# EAGLE design beatrix_B_v1_1 (EAGLE 9.6.2)

## Sheet 1 of 5: Audio I/O
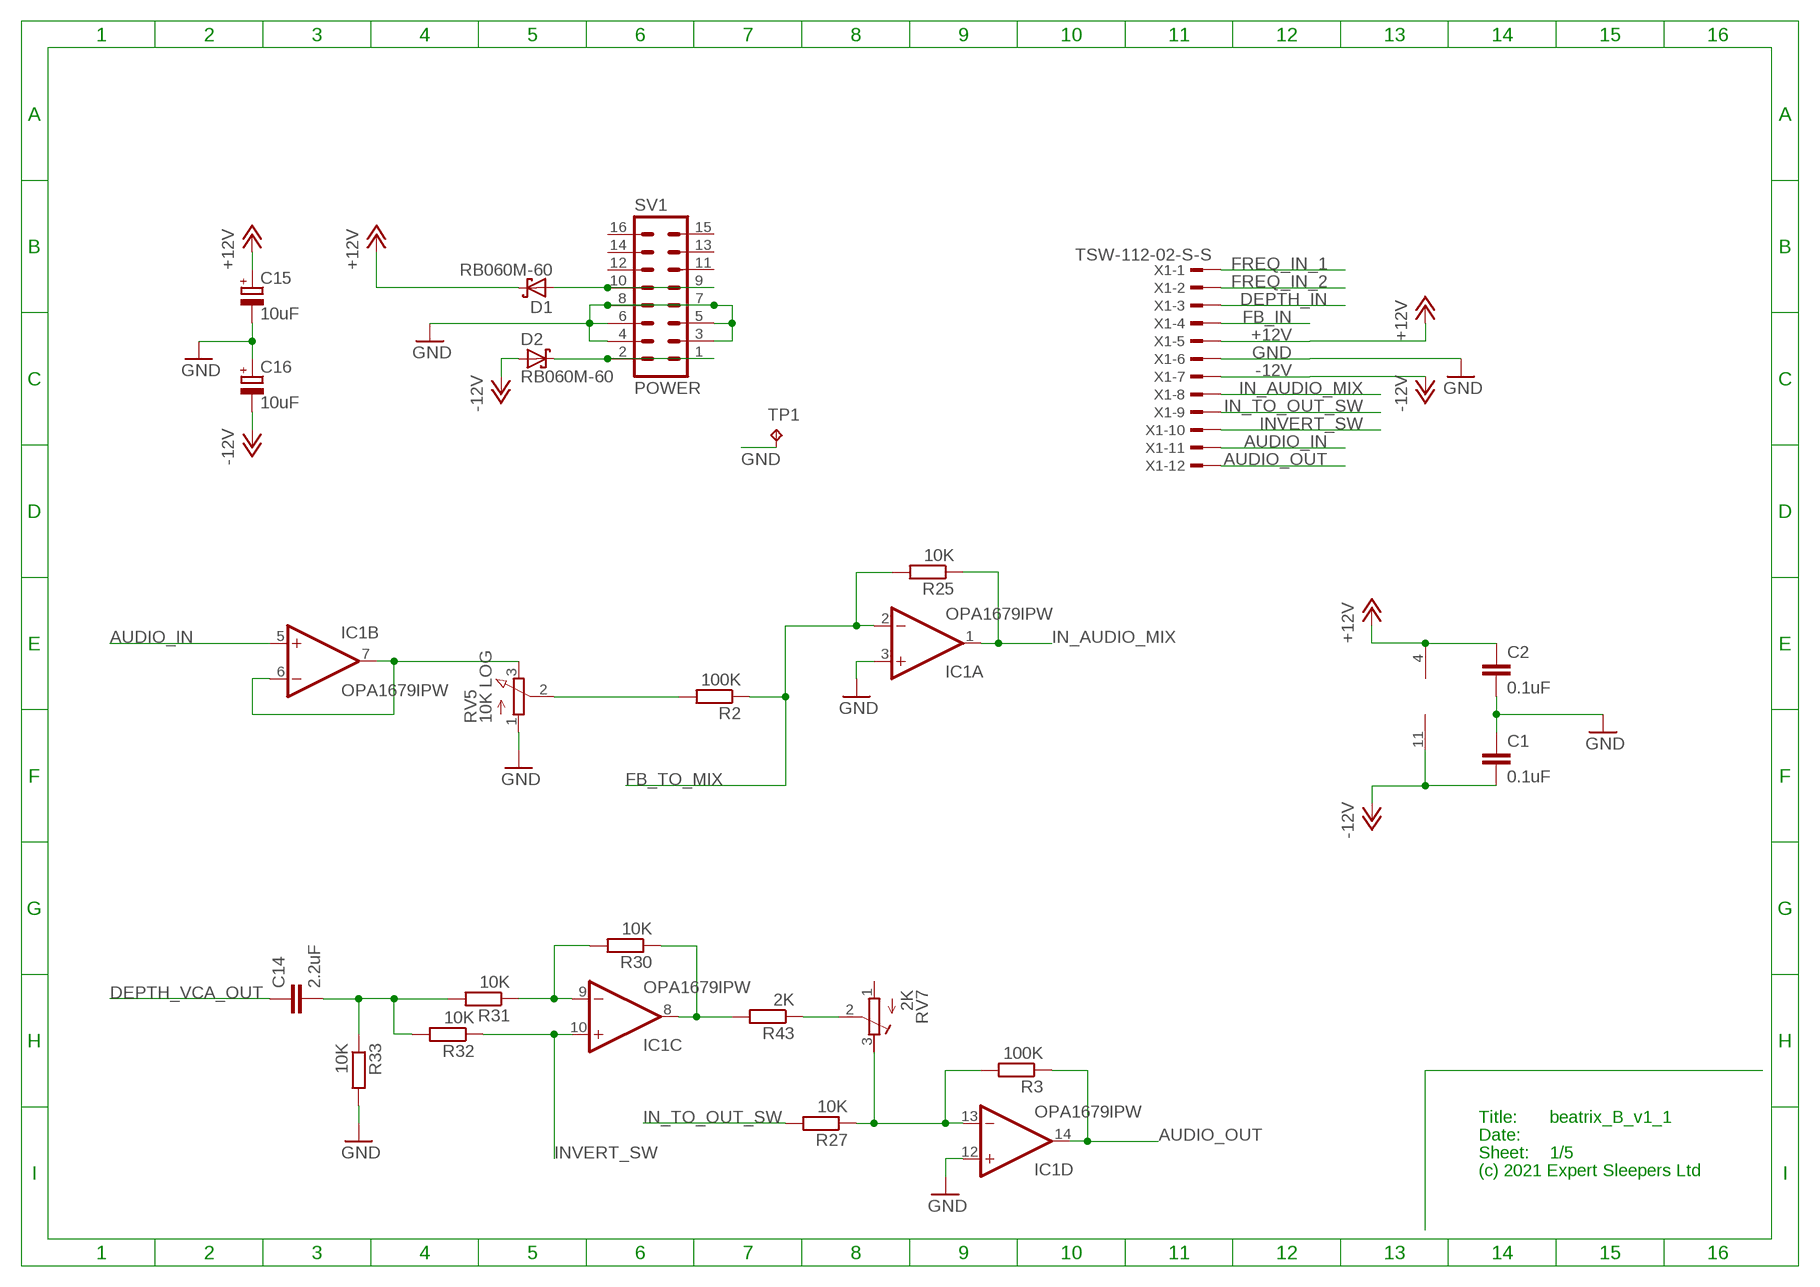
[diagram p0: schematic, sheet 1]

### Parts
C1  0.1uF  C-EUC0402  [C0402]
C2  0.1uF  C-EUC0402  [C0402]
C14  2.2uF  C-EUC0805  [C0805]
C15  10uF  CPOL-EUUD-4X5,8  [UD-4X5,8_NICHICON]
C16  10uF  CPOL-EUUD-4X5,8  [UD-4X5,8_NICHICON]
D1  RB060M-60  [SOD123FL]
D2  RB060M-60  [SOD123FL]
IC1  OPA1679IPW  TL074PW  [PW_R-PDSO-G14]
R2  100K  R-EU_R0603  [R0603]
R3  100K  R-EU_R0603  [R0603]
R25  10K  R-EU_R0603  [R0603]
R27  10K  R-EU_R0603  [R0603]
R30  10K  R-EU_R0603  [R0603]
R31  10K  R-EU_R0603  [R0603]
R32  10K  R-EU_R0603  [R0603]
R33  10K  R-EU_R0603  [R0603]
R43  2K  R-EU_R0603  [R0603]
RV5  10K LOG  RD1610NOA0X  [RD1610NOA0X]
RV7  2K  TC33X  [TC33X]
SV1  POWER  ML16  [ML16]
TP1  RA2  TPPAD1-13  [P1-13]
X1  TSW-112-02-S-S  [TSW-112-02-S-S]

### Nets
+12V: C2.1 C15.+ D1.C IC1.4(P:V+) X1.5 ; also sheet 2,3,4,5
-12V: C1.2 C16.- D2.A IC1.11(P:V-) X1.7 ; also sheet 2,3,4,5
AUDIO_IN: IC1.5(B:+IN) X1.11
AUDIO_OUT: IC1.14(D:OUT) R3.1 X1.12
DEPTH_IN: X1.3 ; also sheet 3
DEPTH_VCA_OUT: C14.1 ; also sheet 3
FB_IN: X1.4 ; also sheet 2
FB_TO_MIX: IC1.2(A:-IN) R2.1 R25.2 ; also sheet 2
FREQ_IN_1: X1.1 ; also sheet 4
FREQ_IN_2: X1.2 ; also sheet 4
GND [power]: C1.1 C2.2 C15.- C16.+ IC1.3(A:+IN) IC1.12(D:+IN) R33.2 RV5.1(A) SV1.3 SV1.4 SV1.5 SV1.6 SV1.7 SV1.8 TP1.TP X1.6 ; also sheet 2,3,4,5
IN_AUDIO_MIX: IC1.1(A:OUT) R25.1 X1.8 ; also sheet 5
IN_TO_OUT_SW: R27.2 X1.9
INVERT_SW: IC1.10(C:+IN) R32.1 X1.10
N$1: D2.C SV1.1 SV1.2
N$3: IC1.8(C:OUT) R30.1 R43.2
N$5: IC1.13(D:-IN) R3.2 R27.1 RV7.3(E)
N$7: IC1.6(B:-IN) IC1.7(B:OUT) RV5.3(E)
N$10: R2.2 RV5.2(S)
N$15: D1.A SV1.9 SV1.10
N$49: C14.2 R31.2 R32.2 R33.1
N$50: R43.1 RV7.2(S)
N$51: IC1.9(C:-IN) R30.2 R31.1
Unconnected: RV7.1(A) SV1.11 SV1.12 SV1.13 SV1.14 SV1.15 SV1.16

### Notes on the sheet
- Title:
- Date:
- Sheet:
- (c) 2021 Expert Sleepers Ltd

## Sheet 2 of 5: Feedback
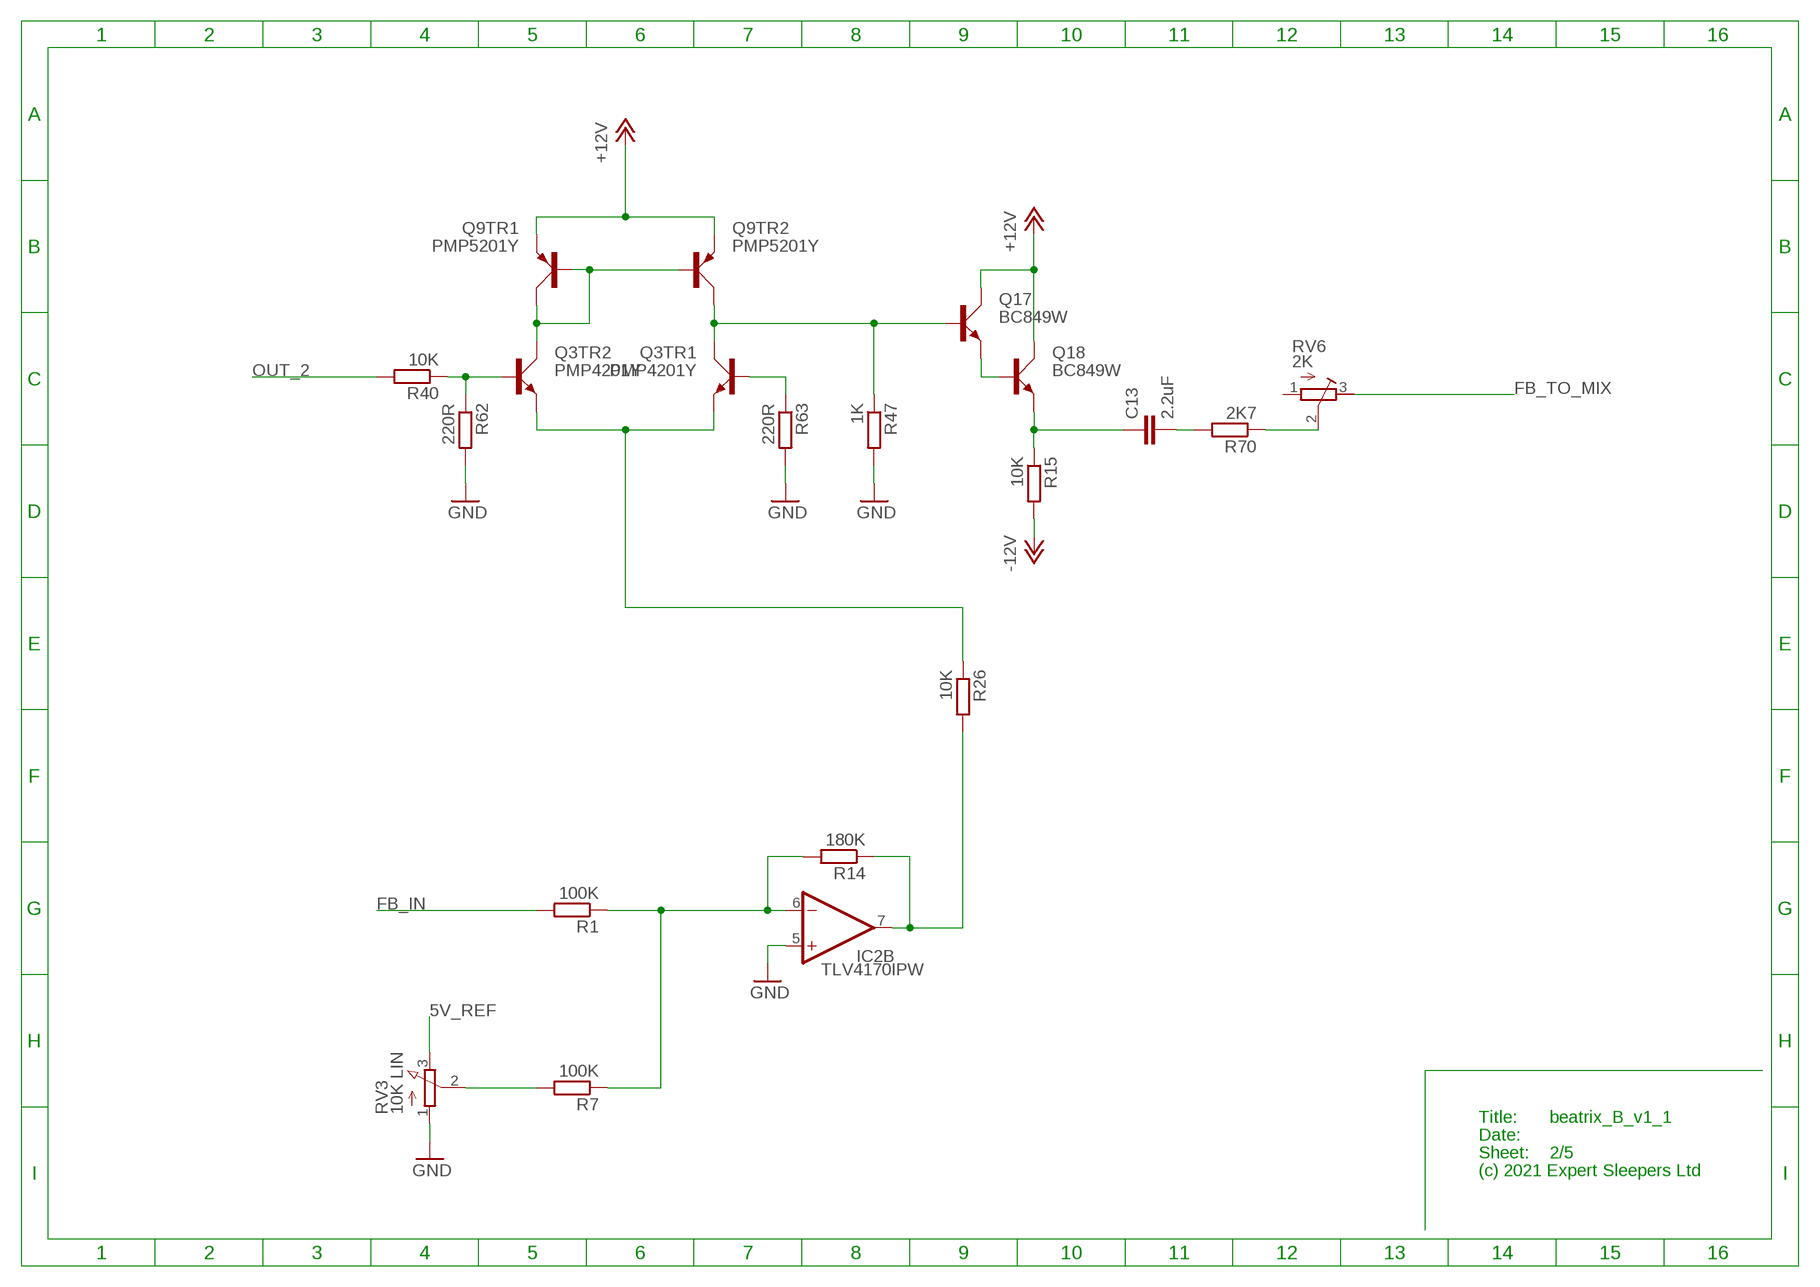
[diagram p1: schematic, sheet 2]

### Parts
C13  2.2uF  C-EUC0805  [C0805]
IC2  TLV4170IPW  TL074PW  [PW_R-PDSO-G14]
Q3  PMP4201Y  [SOT65P210X110-6N]
Q9  PMP5201Y  [SOT65P210X110-6N]
Q17  BC849W  [SOT323]
Q18  BC849W  [SOT323]
R1  100K  R-EU_R0603  [R0603]
R7  100K  R-EU_R0603  [R0603]
R14  180K  R-EU_R0603  [R0603]
R15  10K  R-EU_R0603  [R0603]
R26  10K  R-EU_R0603  [R0603]
R40  10K  R-EU_R0603  [R0603]
R47  1K  R-EU_R0603  [R0603]
R62  220R  R-EU_R0603  [R0603]
R63  220R  R-EU_R0603  [R0603]
R70  2K7  R-EU_R0603  [R0603]
RV3  10K LIN  RD1610NOA0X  [RD1610NOA0X]
RV6  2K  TC33X  [TC33X]

### Nets
5V_REF: RV3.3(E) ; also sheet 3,4
+12V: Q9.4(TR2:E) Q9.5(TR1:E) Q17.3(C) Q18.3(C) ; also sheet 1,3,4,5
-12V: R15.2 ; also sheet 1,3,4,5
FB_IN: R1.2 ; also sheet 1
FB_TO_MIX: RV6.3(E) ; also sheet 1
GND [power]: IC2.5(B:+IN) R47.2 R62.2 R63.2 RV3.1(A) ; also sheet 1,3,4,5
N$4: R70.1 RV6.2(S)
N$9: R7.2 RV3.2(S)
N$14: IC2.6(B:-IN) R1.1 R7.1 R14.2
N$18: IC2.7(B:OUT) R14.1 R26.2
N$21: C13.2 R70.2
N$24: Q3.2(TR2:B) R40.1 R62.1
N$26: Q3.4(TR2:E) Q3.5(TR1:E) R26.1
N$27: C13.1 Q18.2(E) R15.1
N$28: Q3.3(TR2:C) Q9.1(TR1:B) Q9.2(TR2:B) Q9.6(TR1:C)
N$31: Q3.6(TR1:C) Q9.3(TR2:C) Q17.1(B) R47.1
N$32: Q3.1(TR1:B) R63.1
N$34: Q17.2(E) Q18.1(B)
OUT_2: R40.2 ; also sheet 5
Unconnected: RV6.1(A)

### Notes on the sheet
- Title:
- Date:
- Sheet:
- (c) 2021 Expert Sleepers Ltd

## Sheet 3 of 5: Depth
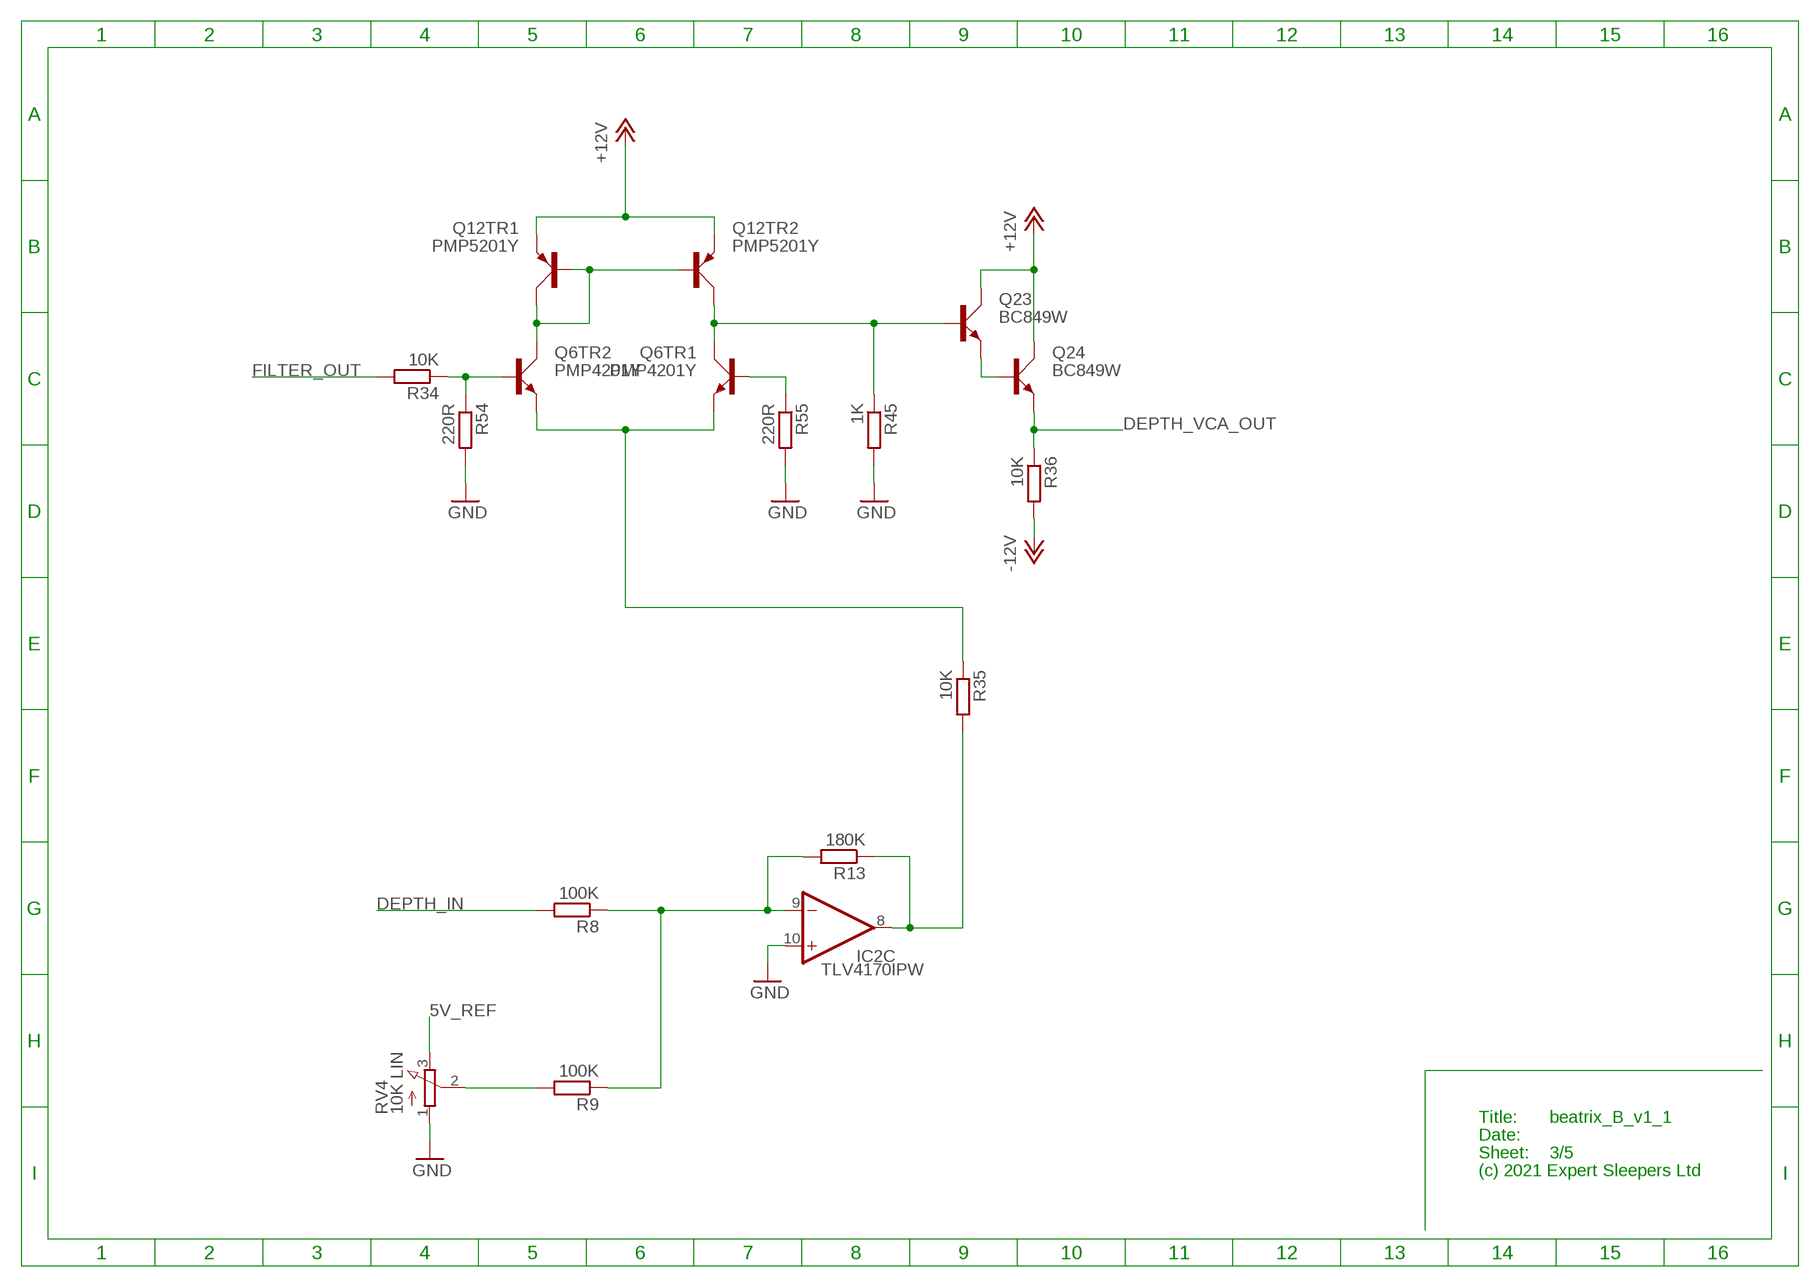
[diagram p2: schematic, sheet 3]

### Parts
Q6  PMP4201Y  [SOT65P210X110-6N]
Q12  PMP5201Y  [SOT65P210X110-6N]
Q23  BC849W  [SOT323]
Q24  BC849W  [SOT323]
R8  100K  R-EU_R0603  [R0603]
R9  100K  R-EU_R0603  [R0603]
R13  180K  R-EU_R0603  [R0603]
R34  10K  R-EU_R0603  [R0603]
R35  10K  R-EU_R0603  [R0603]
R36  10K  R-EU_R0603  [R0603]
R45  1K  R-EU_R0603  [R0603]
R54  220R  R-EU_R0603  [R0603]
R55  220R  R-EU_R0603  [R0603]
RV4  10K LIN  RD1610NOA0X  [RD1610NOA0X]

### Nets
5V_REF: RV4.3(E) ; also sheet 2,4
+12V: Q12.4(TR2:E) Q12.5(TR1:E) Q23.3(C) Q24.3(C) ; also sheet 1,2,4,5
-12V: R36.2 ; also sheet 1,2,4,5
DEPTH_IN: R8.2 ; also sheet 1
DEPTH_VCA_OUT: Q24.2(E) R36.1 ; also sheet 1
FILTER_OUT: R34.2 ; also sheet 5
GND [power]: IC2.10(C:+IN) R45.2 R54.2 R55.2 RV4.1(A) ; also sheet 1,2,4,5
N$12: IC2.9(C:-IN) R8.1 R9.1 R13.2
N$52: IC2.8(C:OUT) R13.1 R35.2
N$58: Q6.2(TR2:B) R34.1 R54.1
N$61: Q6.4(TR2:E) Q6.5(TR1:E) R35.1
N$69: Q6.3(TR2:C) Q12.1(TR1:B) Q12.2(TR2:B) Q12.6(TR1:C)
N$73: Q6.6(TR1:C) Q12.3(TR2:C) Q23.1(B) R45.1
N$74: Q6.1(TR1:B) R55.1
N$78: Q23.2(E) Q24.1(B)
N$86: R9.2 RV4.2(S)

### Notes on the sheet
- Title:
- Date:
- Sheet:
- (c) 2021 Expert Sleepers Ltd

## Sheet 4 of 5: Frequency control
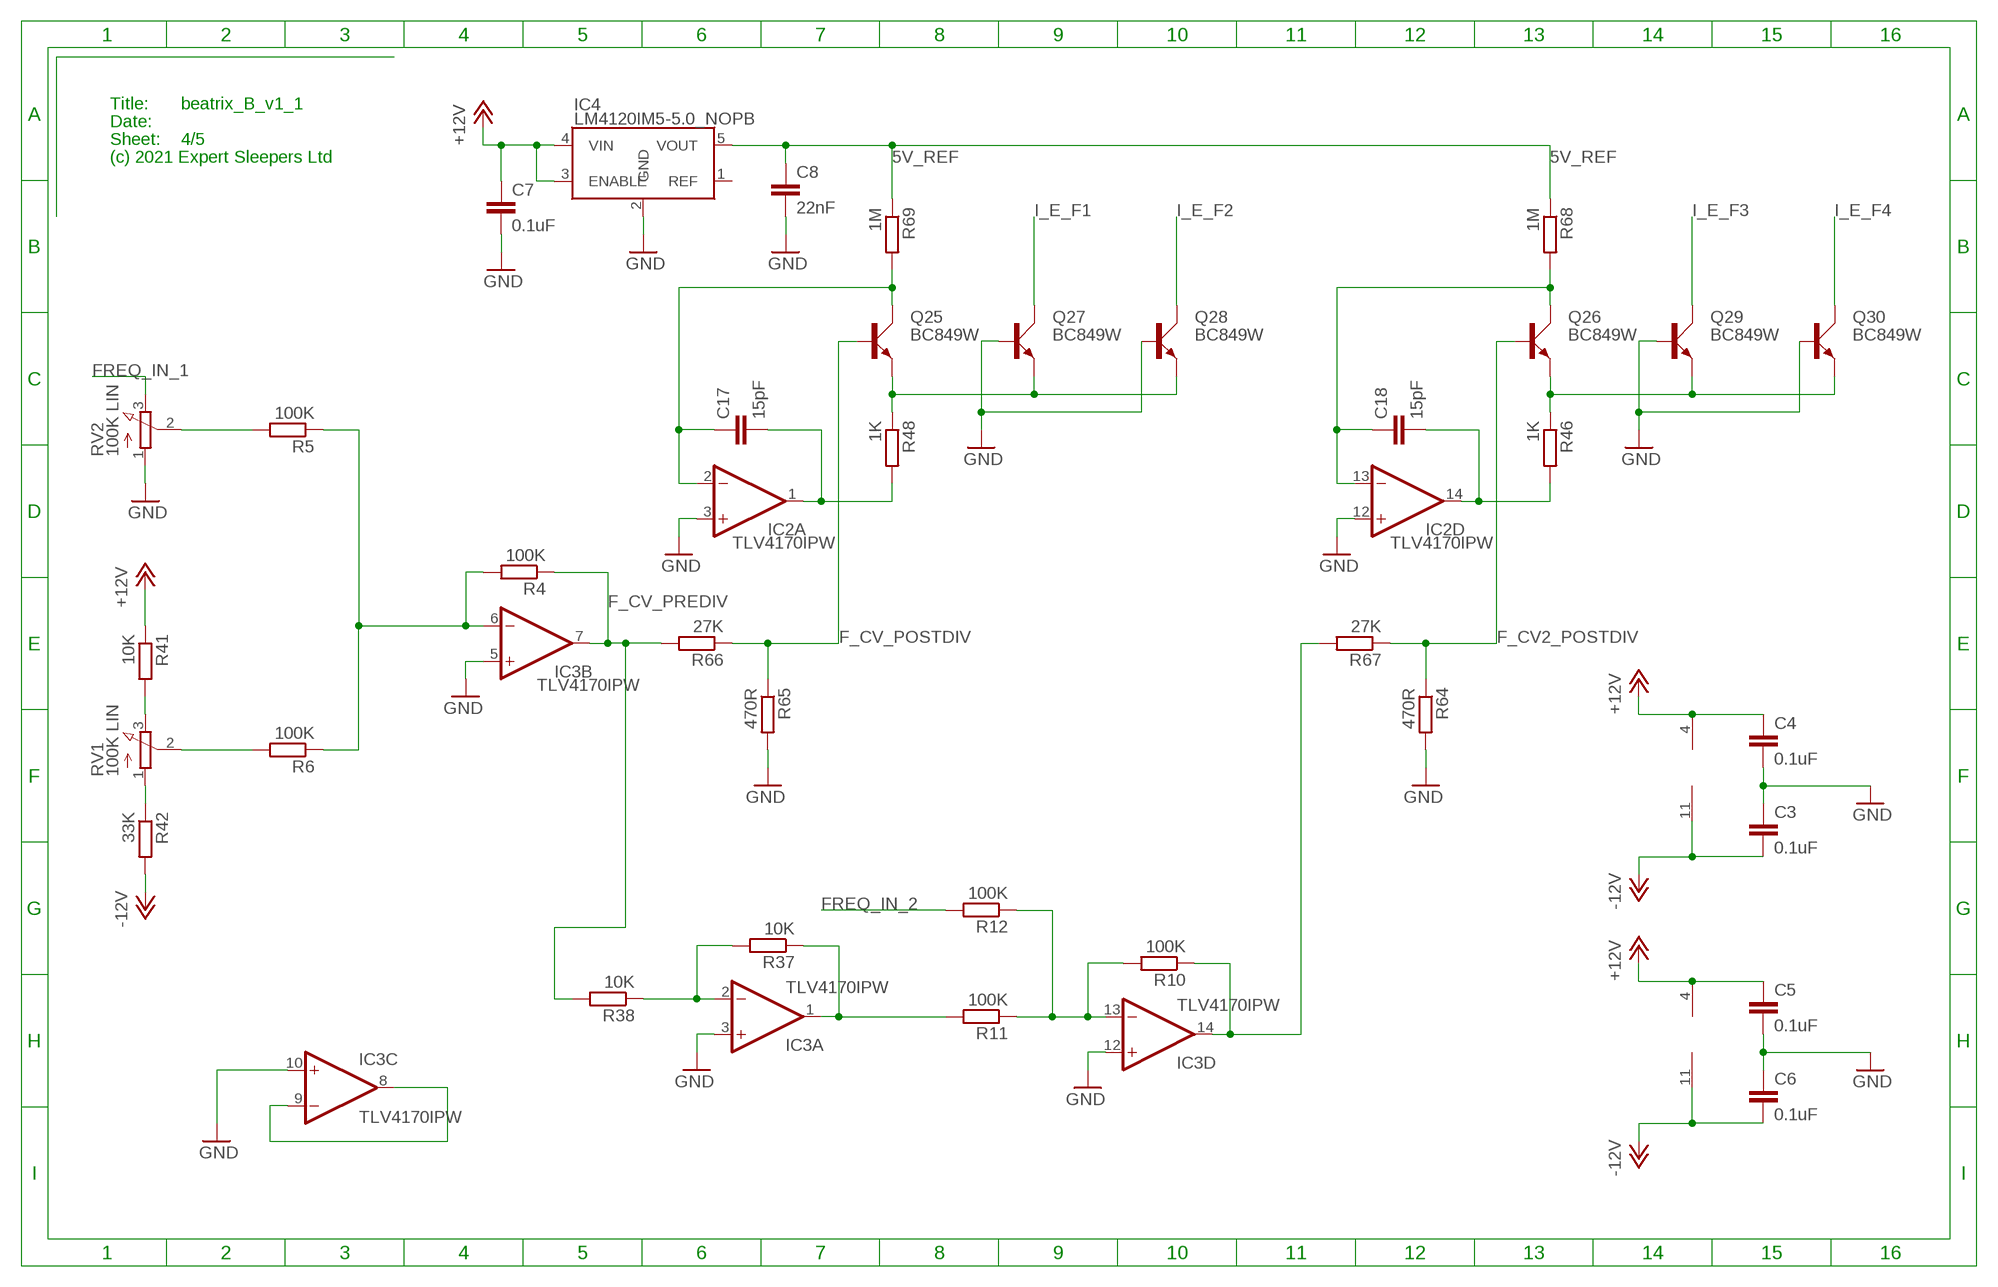
[diagram p3: schematic, sheet 4]

### Parts
C3  0.1uF  C-EUC0402  [C0402]
C4  0.1uF  C-EUC0402  [C0402]
C5  0.1uF  C-EUC0402  [C0402]
C6  0.1uF  C-EUC0402  [C0402]
C7  0.1uF  C-EUC0402  [C0402]
C8  22nF  C-EUC0402  [C0402]
C17  15pF  C-EUC0402  [C0402]
C18  15pF  C-EUC0402  [C0402]
IC3  TLV4170IPW  TL074PW  [PW_R-PDSO-G14]
IC4  LM4120IM5-5.0_NOPB  [SOT95P280X145-5N]
Q25  BC849W  [SOT323]
Q26  BC849W  [SOT323]
Q27  BC849W  [SOT323]
Q28  BC849W  [SOT323]
Q29  BC849W  [SOT323]
Q30  BC849W  [SOT323]
R4  100K  R-EU_R0603  [R0603]
R5  100K  R-EU_R0603  [R0603]
R6  100K  R-EU_R0603  [R0603]
R10  100K  R-EU_R0603  [R0603]
R11  100K  R-EU_R0603  [R0603]
R12  100K  R-EU_R0603  [R0603]
R37  10K  R-EU_R0603  [R0603]
R38  10K  R-EU_R0603  [R0603]
R41  10K  R-EU_R0603  [R0603]
R42  33K  R-EU_R0603  [R0603]
R46  1K  R-EU_R0603  [R0603]
R48  1K  R-EU_R0603  [R0603]
R64  470R  R-EU_R0603  [R0603]
R65  470R  R-EU_R0603  [R0603]
R66  27K  R-EU_R0603  [R0603]
R67  27K  R-EU_R0603  [R0603]
R68  1M  R-EU_R0603  [R0603]
R69  1M  R-EU_R0603  [R0603]
RV1  100K LIN  RD1610NOA0X  [RD1610NOA0X]
RV2  100K LIN  RD1610NOA0X  [RD1610NOA0X]

### Nets
5V_REF: C8.1 IC4.5(VOUT) R68.1 R69.1 ; also sheet 2,3
+12V: C4.1 C5.1 C7.1 IC2.4(P:V+) IC3.4(P:V+) IC4.3(ENABLE) IC4.4(VIN) R41.1 ; also sheet 1,2,3,5
-12V: C3.2 C6.2 IC2.11(P:V-) IC3.11(P:V-) R42.2 ; also sheet 1,2,3,5
F_CV2_POSTDIV: Q26.1(B) R64.1 R67.1
F_CV_POSTDIV: Q25.1(B) R65.1 R66.1
F_CV_PREDIV: IC3.7(B:OUT) R4.1 R38.2 R66.2
FREQ_IN_1: RV2.3(E) ; also sheet 1
FREQ_IN_2: R12.2 ; also sheet 1
GND [power]: C3.1 C4.2 C5.2 C6.1 C7.2 C8.2 IC2.3(A:+IN) IC2.12(D:+IN) IC3.3(A:+IN) IC3.5(B:+IN) IC3.10(C:+IN) IC3.12(D:+IN) IC4.2(GND) Q27.1(B) Q28.1(B) Q29.1(B) Q30.1(B) R64.2 R65.2 RV2.1(A) ; also sheet 1,2,3,5
I_E_F1: Q27.3(C) ; also sheet 5
I_E_F2: Q28.3(C) ; also sheet 5
I_E_F3: Q29.3(C) ; also sheet 5
I_E_F4: Q30.3(C) ; also sheet 5
N$2: R42.1 RV1.1(A)
N$13: IC3.6(B:-IN) R4.2 R5.1 R6.1
N$23: IC3.8(C:OUT) IC3.9(C:-IN)
N$36: R5.2 RV2.2(S)
N$37: R6.2 RV1.2(S)
N$38: R41.2 RV1.3(E)
N$45: Q25.2(E) Q27.2(E) Q28.2(E) R48.1
N$46: C17.1 IC2.2(A:-IN) Q25.3(C) R69.2
N$48: C17.2 IC2.1(A:OUT) R48.2
N$57: Q26.2(E) Q29.2(E) Q30.2(E) R46.1
N$68: C18.1 IC2.13(D:-IN) Q26.3(C) R68.2
N$81: C18.2 IC2.14(D:OUT) R46.2
N$87: IC3.2(A:-IN) R37.2 R38.1
N$89: IC3.1(A:OUT) R11.2 R37.1
N$90: IC3.13(D:-IN) R10.2 R11.1 R12.1
N$93: IC3.14(D:OUT) R10.1 R67.2
Unconnected: IC4.1(REF)

### Notes on the sheet
- Title:
- Date:
- Sheet:
- (c) 2021 Expert Sleepers Ltd

## Sheet 5 of 5: Filter core
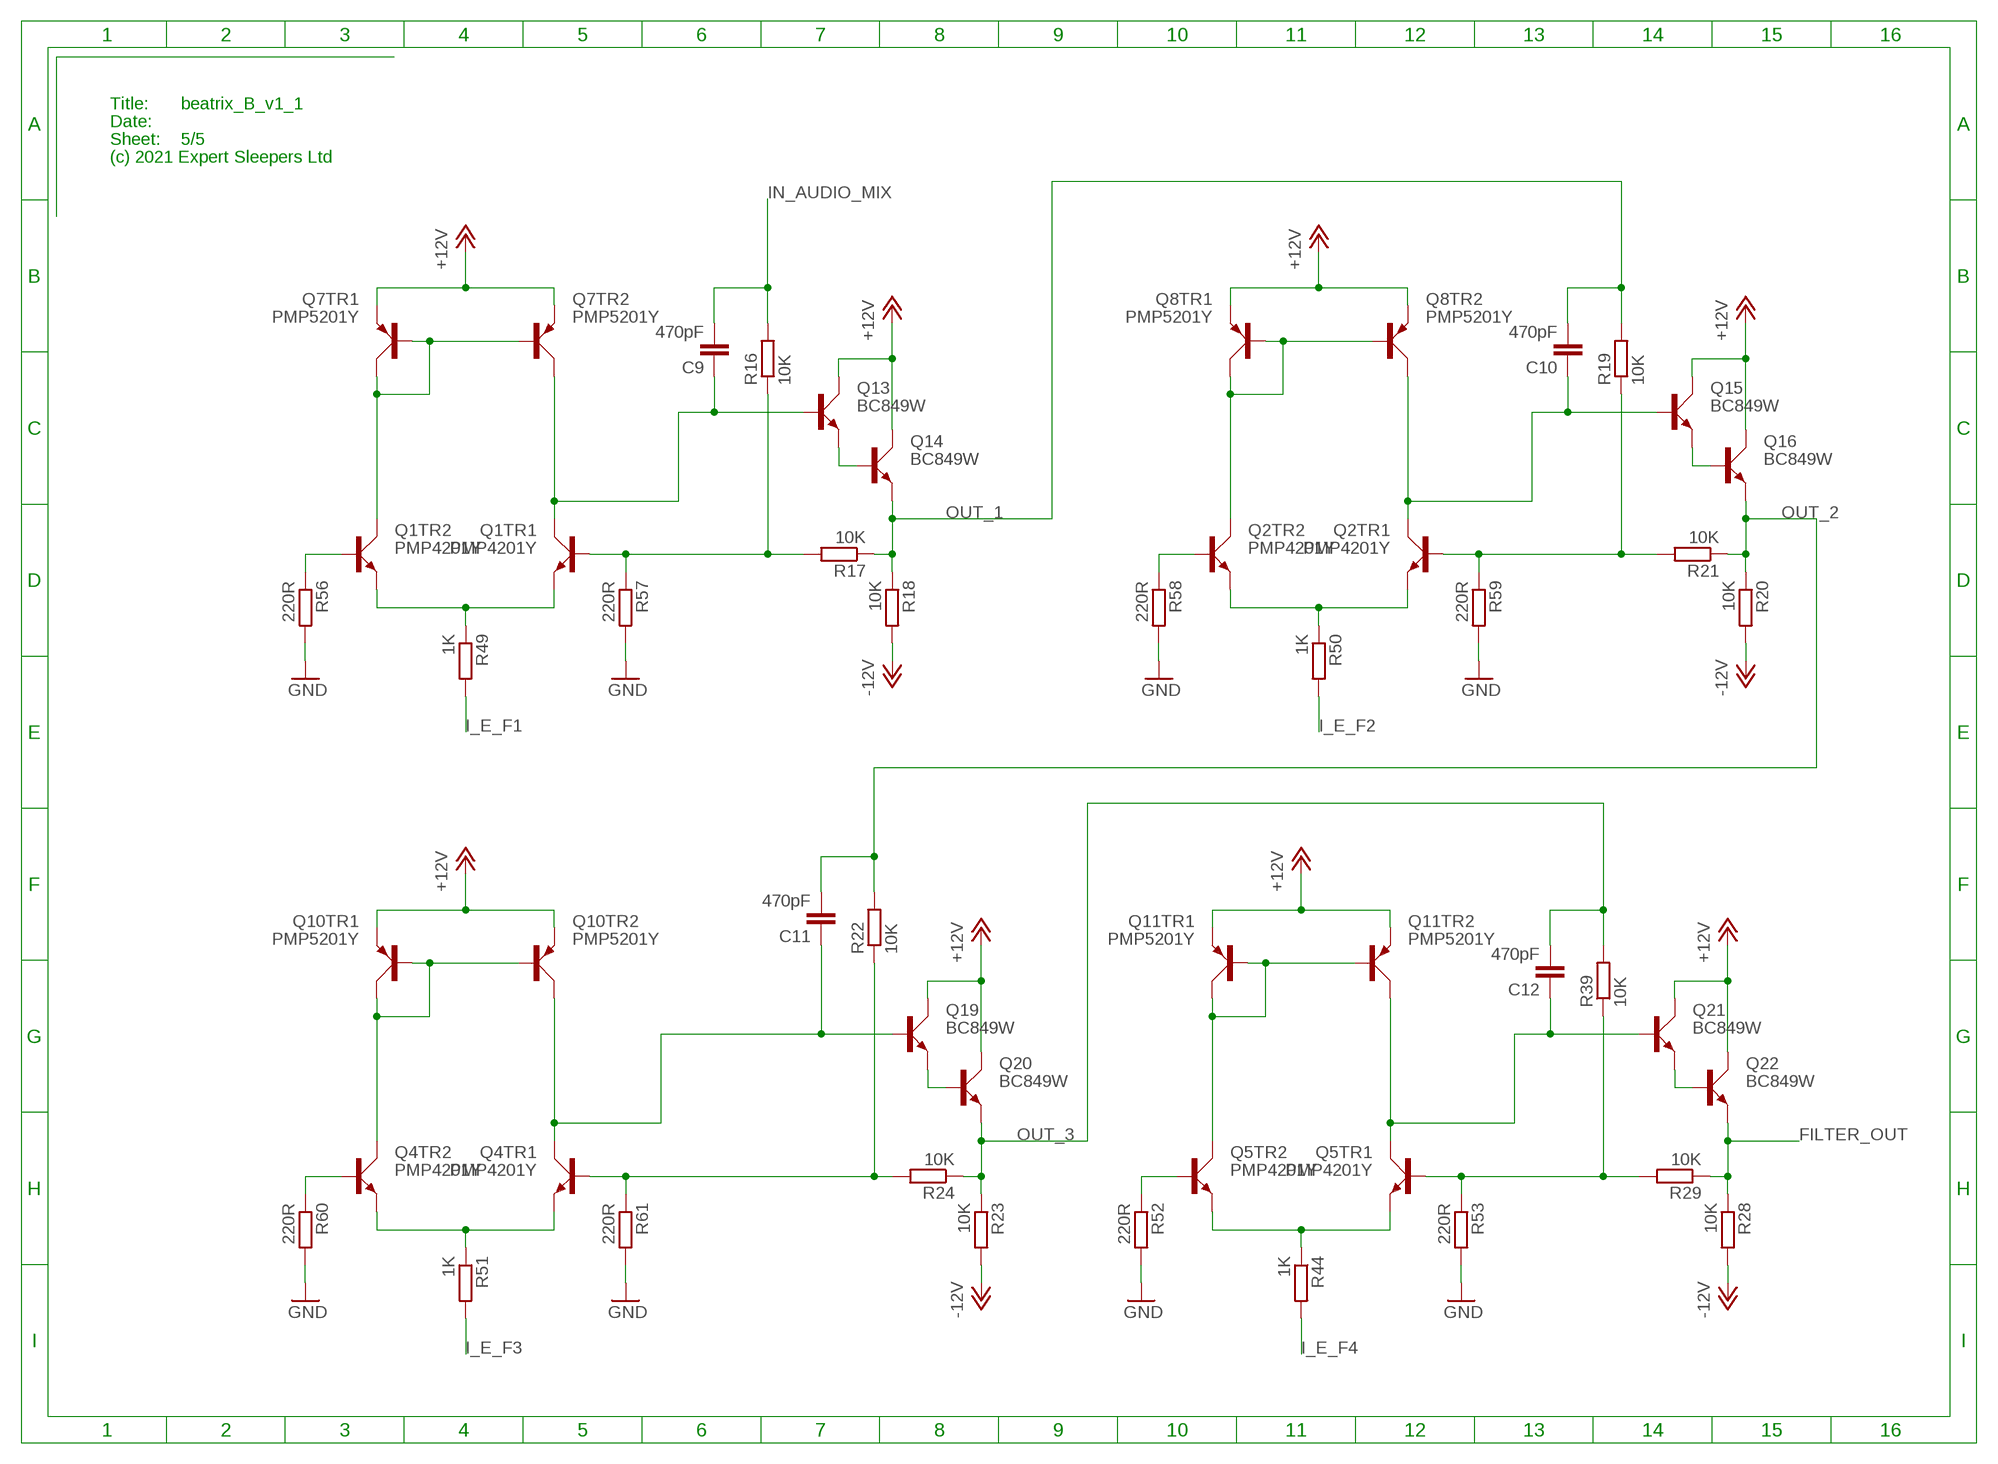
[diagram p4: schematic, sheet 5]

### Parts
C9  470pF  C-EUC0603  [C0603]
C10  470pF  C-EUC0603  [C0603]
C11  470pF  C-EUC0603  [C0603]
C12  470pF  C-EUC0603  [C0603]
Q1  PMP4201Y  [SOT65P210X110-6N]
Q2  PMP4201Y  [SOT65P210X110-6N]
Q4  PMP4201Y  [SOT65P210X110-6N]
Q5  PMP4201Y  [SOT65P210X110-6N]
Q7  PMP5201Y  [SOT65P210X110-6N]
Q8  PMP5201Y  [SOT65P210X110-6N]
Q10  PMP5201Y  [SOT65P210X110-6N]
Q11  PMP5201Y  [SOT65P210X110-6N]
Q13  BC849W  [SOT323]
Q14  BC849W  [SOT323]
Q15  BC849W  [SOT323]
Q16  BC849W  [SOT323]
Q19  BC849W  [SOT323]
Q20  BC849W  [SOT323]
Q21  BC849W  [SOT323]
Q22  BC849W  [SOT323]
R16  10K  R-EU_R0603  [R0603]
R17  10K  R-EU_R0603  [R0603]
R18  10K  R-EU_R0603  [R0603]
R19  10K  R-EU_R0603  [R0603]
R20  10K  R-EU_R0603  [R0603]
R21  10K  R-EU_R0603  [R0603]
R22  10K  R-EU_R0603  [R0603]
R23  10K  R-EU_R0603  [R0603]
R24  10K  R-EU_R0603  [R0603]
R28  10K  R-EU_R0603  [R0603]
R29  10K  R-EU_R0603  [R0603]
R39  10K  R-EU_R0603  [R0603]
R44  1K  R-EU_R0603  [R0603]
R49  1K  R-EU_R0603  [R0603]
R50  1K  R-EU_R0603  [R0603]
R51  1K  R-EU_R0603  [R0603]
R52  220R  R-EU_R0603  [R0603]
R53  220R  R-EU_R0603  [R0603]
R56  220R  R-EU_R0603  [R0603]
R57  220R  R-EU_R0603  [R0603]
R58  220R  R-EU_R0603  [R0603]
R59  220R  R-EU_R0603  [R0603]
R60  220R  R-EU_R0603  [R0603]
R61  220R  R-EU_R0603  [R0603]

### Nets
+12V: Q7.4(TR2:E) Q7.5(TR1:E) Q8.4(TR2:E) Q8.5(TR1:E) Q10.4(TR2:E) Q10.5(TR1:E) Q11.4(TR2:E) Q11.5(TR1:E) Q13.3(C) Q14.3(C) Q15.3(C) Q16.3(C) Q19.3(C) Q20.3(C) Q21.3(C) Q22.3(C) ; also sheet 1,2,3,4
-12V: R18.2 R20.2 R23.2 R28.2 ; also sheet 1,2,3,4
FILTER_OUT: Q22.2(E) R28.1 R29.1 ; also sheet 3
GND [power]: R52.2 R53.2 R56.2 R57.2 R58.2 R59.2 R60.2 R61.2 ; also sheet 1,2,3,4
I_E_F1: R49.2 ; also sheet 4
I_E_F2: R50.2 ; also sheet 4
I_E_F3: R51.2 ; also sheet 4
I_E_F4: R44.2 ; also sheet 4
IN_AUDIO_MIX: C9.2 R16.2 ; also sheet 1
N$20: Q1.2(TR2:B) R56.1
N$35: Q5.2(TR2:B) R52.1
N$39: Q1.4(TR2:E) Q1.5(TR1:E) R49.1
N$40: Q5.4(TR2:E) Q5.5(TR1:E) R44.1
N$41: C12.1 Q5.6(TR1:C) Q11.3(TR2:C) Q21.1(B)
N$42: Q5.1(TR1:B) R29.2 R39.1 R53.1
N$43: Q21.2(E) Q22.1(B)
N$44: Q5.3(TR2:C) Q11.1(TR1:B) Q11.2(TR2:B) Q11.6(TR1:C)
N$53: C9.1 Q1.6(TR1:C) Q7.3(TR2:C) Q13.1(B)
N$54: Q1.3(TR2:C) Q7.1(TR1:B) Q7.2(TR2:B) Q7.6(TR1:C)
N$55: Q1.1(TR1:B) R16.1 R17.2 R57.1
N$56: Q13.2(E) Q14.1(B)
N$59: Q2.2(TR2:B) R58.1
N$60: Q2.4(TR2:E) Q2.5(TR1:E) R50.1
N$64: C10.1 Q2.6(TR1:C) Q8.3(TR2:C) Q15.1(B)
N$67: Q2.1(TR1:B) R19.1 R21.2 R59.1
N$70: Q15.2(E) Q16.1(B)
N$77: Q2.3(TR2:C) Q8.1(TR1:B) Q8.2(TR2:B) Q8.6(TR1:C)
N$79: Q4.2(TR2:B) R60.1
N$80: Q4.4(TR2:E) Q4.5(TR1:E) R51.1
N$82: C11.1 Q4.6(TR1:C) Q10.3(TR2:C) Q19.1(B)
N$83: Q4.1(TR1:B) R22.1 R24.2 R61.1
N$84: Q19.2(E) Q20.1(B)
N$85: Q4.3(TR2:C) Q10.1(TR1:B) Q10.2(TR2:B) Q10.6(TR1:C)
OUT_1: C10.2 Q14.2(E) R17.1 R18.1 R19.2
OUT_2: C11.2 Q16.2(E) R20.1 R21.1 R22.2 ; also sheet 2
OUT_3: C12.2 Q20.2(E) R23.1 R24.1 R39.2

### Notes on the sheet
- Title:
- Date:
- Sheet:
- (c) 2021 Expert Sleepers Ltd

## Library data of the parts
C1-C14 C17 C18 = rcl:C-EU: CAPACITOR, European symbol
C15 C16 = rcl:CPOL-EU: POLARIZED CAPACITOR, European symbol
D1 D2 = rohm2:RB060M-60: Schottky Barrier Diode
IC1-IC3 = digital-audio:TL074: OP AMP
IC4 = SamacSys_Parts:LM4120IM5-5.0_NOPB: 0.2% 50ppm/C Drift Precision Series Voltage Reference with Shutdown Enable Source: Datasheet <http://www.ti.com/lit/ds/symlink/lm4120.pdf>; ARROW_PART_NUMBER: LM4120IM5-5.0/NOPB; ARROW_PRICE-STOCK: https://www.arrow.com/en/products/lm4120im5-5.0nopb/texas-instruments; DESCRIPTION: 0.2% 50ppm/C Drift Precision Series Voltage Reference with Shutdown Enable; HEIGHT: 1.45mm; MANUFACTURER_NAME: Texas Instruments; MANUFACTURER_PART_NUMBER: LM4120IM5-5.0/NOPB; MOUSER_PART_NUMBER: 926-LM4120IM550NOPB; MOUSER_PRICE-STOCK: https://www.mouser.co.uk/ProductDetail/Texas-Instruments/LM4120IM5-50-NOPB?qs=QbsRYf82W3GnvXCg2jf3mg%3D%3D
Q1-Q6 = SamacSys_Parts:PMP4201Y: Bipolar Transistors - BJT MATCHED PAIR Source: Datasheet <https://componentsearchengine.com/Datasheets/1/PMP4201Y,135.pdf>; ARROW_PART_NUMBER: PMP4201Y,135; ARROW_PRICE-STOCK: https://www.arrow.com/en/products/pmp4201y135/nexperia; DESCRIPTION: Bipolar Transistors - BJT MATCHED PAIR; HEIGHT: 1.1mm; MANUFACTURER_NAME: Nexperia; MANUFACTURER_PART_NUMBER: PMP4201Y,135; MOUSER_PART_NUMBER: 771-PMP4201Y135; MOUSER_PRICE-STOCK: https://www.mouser.co.uk/ProductDetail/Nexperia/PMP4201Y135?qs=LOCUfHb8d9uqwNS3d98RHQ%3D%3D
Q7-Q12 = SamacSys_Parts:PMP5201Y: Bipolar Transistors - BJT MATCHED PAIR Source: Datasheet <https://eu.mouser.com/datasheet/2/268/40001414E-1066494.pdf>; ARROW_PART_NUMBER: PMP5201Y,135; ARROW_PRICE-STOCK: https://www.arrow.com/en/products/pmp5201y135/nexperia; DESCRIPTION: Bipolar Transistors - BJT MATCHED PAIR; HEIGHT: 1.1mm; MANUFACTURER_NAME: Nexperia; MANUFACTURER_PART_NUMBER: PMP5201Y,135; MOUSER_PART_NUMBER: 771-PMP5201Y135; MOUSER_PRICE-STOCK: https://www.mouser.co.uk/ProductDetail/Nexperia/PMP5201Y135?qs=LOCUfHb8d9vvvsx1DGNhtA%3D%3D
Q13-Q30 = NXP:BC849W
R1-R70 = rcl:R-EU_: RESISTOR, European symbol
RV1-RV5 = soundwell:RD1610NOA0X: 16mm Potentiometer one level Source: http://www.alphapotentiometers.net/html/16mm_pot_2.html
RV6 RV7 = bourns:TC33X
SV1 = digital-audio:ML16: MULTICOMP - MC9A12-1634
TP1 = testpad:TP: Test pad
X1 = con-samtec:TSW-112-02-S-S: THROUGH-HOLE .025" SQ POST HEADER Source: Samtec TSW.pdf; OC_FARNELL: unknown; OC_NEWARK: unknown

## Board
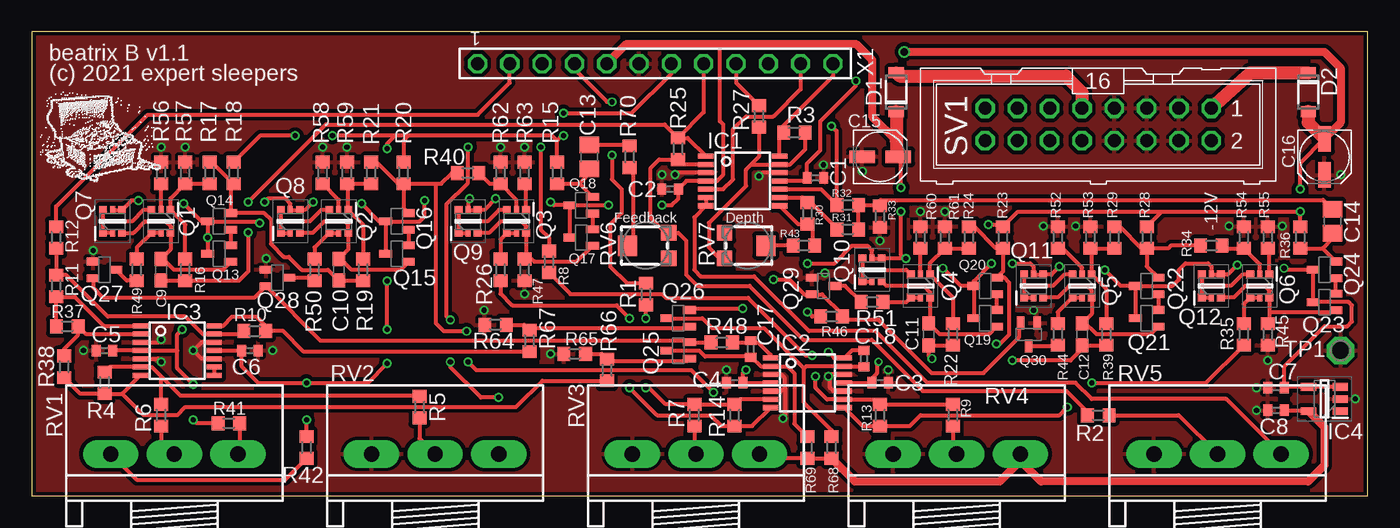
[diagram p5: board, top side]
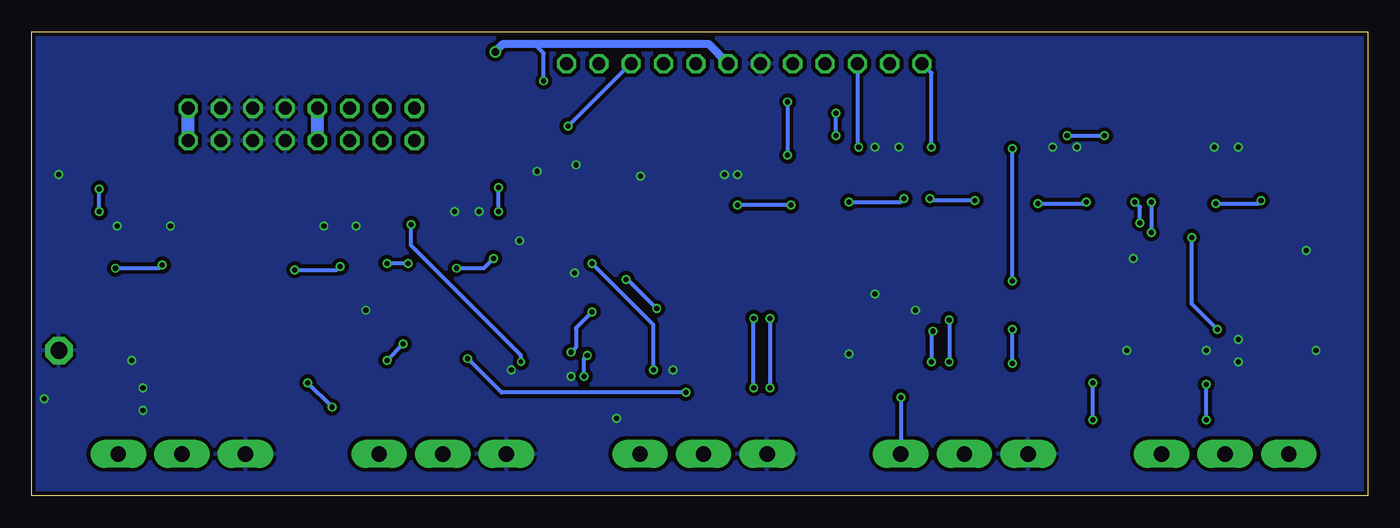
[diagram p6: board, bottom side, seen from below]

Size 105 x 36.5 mm. Coordinates in mm from the lower left corner, seen from the top.
Outline: 0,0 105,0 105,36.5 0,36.5 0,0
Copper layers (1*16): Top 0.035mm / dielectric 1.5mm / Bottom 0.035mm
Design rules "pcbtrain *": minimum track width 0.125mm, minimum drill 0.3mm, track to track 0.125mm, track to pad 0.125mm, pad to pad 0.125mm, via to via 0.125mm, smd to smd 0.125mm, copper to edge 0.25mm, drill to drill 8mil, minimum pad ring 0.15mm, minimum via ring 0.15mm, stop-mask expansion 4mil, vias tented up to drill 0mil, thermal gap 10mil

### Footprints (pad centres in the part's own frame; a part is rotated, then mirrored left to right if it is on the bottom)
C0402 = smd 0.7 x 0.9: 1 -0.65,0; 2 0.65,0
C0603 = smd 1.1 x 1: 1 -0.85,0; 2 0.85,0
C0805 = smd 1.3 x 1.5: 1 -0.95,0; 2 0.95,0
UD-4X5,8_NICHICON = smd 2 x 1: + 1.425,0; - -1.425,0
SOD123FL = smd 0.85 x 1.2: A 1.525,0; C -1.525,0
PW_R-PDSO-G14 = smd 0.4 x 1.2: 1 -1.95,-2.9; 2 -1.3,-2.9; 3 -0.65,-2.9; 4 0,-2.9; 5 0.65,-2.9; 6 1.3,-2.9; 7 1.95,-2.9; 8 1.95,2.9; 9 1.3,2.9; 10 0.65,2.9; 11 0,2.9; 12 -0.65,2.9; 13 -1.3,2.9; 14 -1.95,2.9
SOT95P280X145-5N = smd 1.2 x 0.6: 1 -1.25,0.95; 2 -1.25,0; 3 -1.25,-0.95; 4 1.25,-0.95; 5 1.25,0.95
SOT65P210X110-6N = smd 0.6 x 0.6: 1 -0.9,0.75; 3 -0.9,-0.75; 4 0.9,-0.75; 6 0.9,0.75 | smd 0.6 x 0.4: 2 -0.9,0; 5 0.9,0
SOT323 = smd 0.6 x 1: 1 -0.65,-0.9; 2 0.65,-0.9; 3 0,0.9
R0603 = smd 1 x 1.1: 1 -0.85,0; 2 0.85,0
RD1610NOA0X = drill 1.2 pad 2.184 long: 1 -5,3.8; 2 0,3.8; 3 5,3.8
TC33X = smd 1.2 x 1.2: 1 -1,-1.8; 3 1,-1.8 | smd 1.6 x 1.5: 2 0,1.45
ML16 = drill 1.016 octagon: 1 -8.89,-1.27; 2 -8.89,1.27; 3 -6.35,-1.27; 4 -6.35,1.27; 5 -3.81,-1.27; 6 -3.81,1.27; 7 -1.27,-1.27; 8 -1.27,1.27; 9 1.27,-1.27; 10 1.27,1.27; 11 3.81,-1.27; 12 3.81,1.27; 13 6.35,-1.27; 14 6.35,1.27; 15 8.89,-1.27; 16 8.89,1.27
P1-13 = drill 1.321 pad 2.159 octagon: TP 0,0
TSW-112-02-S-S = drill 1 pad 1.5 octagon: 1 13.97,0; 2 11.43,0; 3 8.89,0; 4 6.35,0; 5 3.81,0; 6 1.27,0; 7 -1.27,0; 8 -3.81,0; 9 -6.35,0; 10 -8.89,0; 11 -11.43,0; 12 -13.97,0

### Placement (x,y rotation side)
C1  61.59,25.02 180 top
C2  50.16,24.13 180 top
C3  66.67,8.89 180 top
C4  55.24,8.89 180 top
C5  5.71,11.43 180 top
C6  17.14,11.43 180 top
C7  97.79,8.51 180 top
C8  97.79,6.73 180 top
C9  10.16,17.78 270 top
C10  24.13,17.78 270 top
C11  70.48,12.7 270 top
C12  82.55,12.7 270 top
C13  43.81,26.67 90 top
C14  102.23,21.59 90 top
C15  66.67,26.67 0 top
C16  101.6,26.67 270 top
C17  56.52,11.56 90 top
C18  65.41,10.79 90 top
D1  67.94,31.75 90 top
D2  100.33,31.75 270 top
IC1  55.88,24.77 270 top
IC2  60.96,8.89 270 top
IC3  11.43,11.43 270 top
IC4  101.6,7.62 180 top
Q1  10.16,21.59 270 top
Q2  24.13,21.59 270 top
Q3  38.1,21.59 270 top
Q4  69.85,16.51 270 top
Q5  82.55,16.51 270 top
Q6  96.52,16.51 270 top
Q7  6.35,21.59 90 top
Q8  20.32,21.59 90 top
Q9  34.29,21.59 90 top
Q10  66.04,17.78 90 top
Q11  78.74,16.51 90 top
Q12  92.71,16.51 90 top
Q13  14.73,19.05 90 top
Q14  14.73,21.59 90 top
Q15  28.7,19.05 90 top
Q16  28.7,21.59 90 top
Q17  43.18,20.32 90 top
Q18  43.18,22.86 90 top
Q19  74.93,13.97 90 top
Q20  74.93,16.51 90 top
Q21  87.63,13.97 90 top
Q22  87.63,16.51 90 top
Q23  101.6,15.24 90 top
Q24  101.6,17.78 90 top
Q25  50.8,11.43 90 top
Q26  50.8,13.97 90 top
Q27  5.71,17.78 270 top
Q28  19.3,17.14 270 top
Q29  62.23,16.51 270 top
Q30  78.36,12.7 180 top
R1  48.26,15.88 90 top
R2  83.82,6.35 0 top
R3  59.94,28.57 0 top
R4  5.71,8.89 90 top
R5  30.48,6.99 270 top
R6  10.16,6.35 270 top
R7  52.07,6.35 270 top
R8  40.64,18.41 90 top
R9  72.39,6.35 270 top
R10  17.53,12.95 180 top
R11  1.91,16.51 270 top
R12  1.91,20.32 90 top
R13  66.67,6.35 90 top
R14  55.24,6.35 90 top
R15  41.27,25.4 90 top
R16  12.06,17.78 270 top
R17  13.97,25.4 270 top
R18  15.88,25.4 90 top
R19  26.04,17.78 270 top
R20  29.21,25.4 90 top
R21  26.67,25.4 270 top
R22  72.39,12.7 270 top
R23  76.33,20.32 90 top
R24  73.66,20.32 270 top
R25  50.8,27.3 270 top
R26  36.83,17.78 270 top
R27  57.15,29.84 90 top
R28  87.63,20.32 90 top
R29  85.09,20.32 270 top
R30  60.96,22.23 90 top
R31  64.14,20.95 0 top
R32  64.14,22.86 0 top
R33  66.67,21.97 270 top
R34  92.71,19.68 180 top
R35  95.25,12.7 270 top
R36  99.69,20.32 90 top
R37  2.79,13.34 0 top
R38  2.54,10.16 270 top
R39  84.45,12.7 270 top
R40  34.29,25.4 180 top
R41  15.49,5.71 0 top
R42  21.59,3.81 90 top
R43  60.69,19.68 0 top
R44  80.64,12.7 270 top
R45  97.16,12.7 270 top
R46  62.87,14.1 180 top
R47  38.73,17.78 270 top
R48  54.23,12.06 0 top
R49  8.26,17.78 270 top
R50  22.23,17.78 270 top
R51  66.04,15.24 180 top
R52  80.64,20.32 90 top
R53  83.19,20.32 90 top
R54  95.25,20.32 90 top
R55  97.16,20.32 90 top
R56  10.16,25.4 90 top
R57  12.06,25.4 90 top
R58  22.86,25.4 90 top
R59  24.77,25.4 90 top
R60  69.85,20.32 90 top
R61  71.75,20.32 90 top
R62  36.83,25.4 90 top
R63  38.73,25.4 90 top
R64  36.45,13.46 180 top
R65  42.67,11.18 180 top
R66  45.21,9.91 270 top
R67  39.12,12.19 270 top
R68  62.87,3.81 90 top
R69  60.96,3.81 90 top
R70  46.99,26.67 90 top
RV1  11.2,-0.5 0 top
RV2  31.7,-0.5 0 top
RV3  52.2,-0.5 0 top
RV4  72.7,-0.5 0 top
RV5  93.2,-0.5 0 top
RV6  48.26,19.68 90 top
RV7  56.24,19.68 270 top
SV1  83.82,29.21 180 top
TP1  102.87,11.43 0 top
U$2  [TREASURE_10MM_300DPI]  0.27,24.66 0 top
X1  49,34 180 top

### Tracks (layer width: path | path; a pad name or v marks a point on that pad's centre or on a via)
5V_REF
  Top 0.305: R68.1 R69.1 57.54,2.96 RV3.3 | IC4.5 98.5,6.67 C8.1
  Top 0.61: R68.1 64.68,1.14 76.07,1.14 77.7,2.77 | 77.7,2.77 RV4.3 | IC4.5 101.6,5.42 101.6,2.41 100.33,1.14 79.33,1.14 77.7,2.77
+12V  (via drill 0.4)
  Top 0.305: Q7.5 Q7.4 7.85,23.24 v8.38,23.24 | Q14.3 v13.83,20.32 Q13.3 | Q16.3 Q15.3 | Q20.3 Q19.3 | Q22.3 Q21.3 | Q18.3 Q17.3 | C5.1 IC3.4 11.43,11.43 | IC2.4 C4.1 55.9,9.67 v56.13,9.91 | IC4.3 IC4.4 98.5,8.57 C7.1 98.44,10.18 101.6,13.34 103.38,13.34 103.76,13.72 103.76,14.99 103.5,15.24 Q23.3 Q24.3 98.55,17.78 v98.42,17.91 | Q22.3 89.66,16.51 90.17,17.02 90.17,17.78 90.68,18.29 92.46,18.29 92.71,18.03 Q12.5 Q12.4 93.99,17.41 v94.74,18.16 | Q22.3 85.6,16.51 v84.33,17.78 | v80.77,18.03 80.15,17.41 Q11.4 Q11.5 78.74,18.03 78.49,18.29 v77.09,18.29 | Q20.3 74.03,16.88 v75.44,18.29 | Q20.3 73.03,16.51 v71.63,17.91 | v68.71,18.67 68.7,18.68 68.58,18.68 | 68.58,18.68 Q10.4 Q10.5 66.04,19.3 65.71,19.64 64.44,19.64 63.09,18.29 v60.96,18.29 | 68.58,18.68 68.33,18.93 v68.33,22.35 | v68.33,24.26 68.33,26.44 67.94,26.82 | Q14.3 13.34,21.59 v11.94,22.99 | Q14.3 17.78,21.59 v17.9,21.47 | v18.29,23.11 18.54,23.37 19.94,23.37 20.32,22.99 Q8.5 Q8.4 21.47,22.49 v22.1,23.11 | Q16.3 27.3,21.59 v25.91,22.99 | Q16.3 30.48,21.59 30.86,21.97 v30.86,23.24 | v34.42,23.37 34.29,23.24 Q9.5 Q9.4 35.57,22.49 v36.45,23.37 | Q18.3 41.02,22.86 v40.77,23.11 | Q18.3 v45.34,22.86 | 54.36,35.56 54.08,35.31 54.08,29.46 54.36,29.21 54.36,25.27 53.85,24.77 IC1.4 51.45,24.77 C2.1 50.81,23.38 50.29,22.86 v49.53,22.86 | R41.1 12.95,5.71 v12.7,5.97 | v12.7,8.76 11.43,10.03 11.43,11.43 | 11.43,11.43 11.43,12.7 v11.81,13.08
  Top 0.61: X1.5 46.75,35.56 54.36,35.56 64.77,35.56 66.04,34.29 66.04,29.84 67.94,27.94
  Top 1.016: D1.C 67.94,27.94 67.94,26.82 C15.+
  Bottom 0.305: v98.42,17.91 95,17.91 v94.74,18.16 | v84.33,17.78 81.03,17.78 v80.77,18.03 | v75.44,18.29 v77.09,18.29 | v71.63,17.91 69.47,17.91 v68.71,18.67 | v68.33,22.35 v68.33,24.26 | v11.94,22.99 8.64,22.99 v8.38,23.24 | v17.9,21.47 17.9,22.73 v18.29,23.11 | v25.91,22.99 22.23,22.99 v22.1,23.11 | v30.86,23.24 34.29,23.24 v34.42,23.37 | v40.77,23.11 36.7,23.11 v36.45,23.37 | v45.34,22.86 v49.53,22.86 | v12.7,5.97 v12.7,8.76 | v11.81,13.08 13.83,15.1 v13.83,20.32 | v56.13,9.91 56.13,13.46 v60.96,18.29
-12V  (via drill 0.35, 0.4, 0.6)
  Top 0.305: IC3.11 C6.2 16.5,10.18 17.78,8.89 v21.59,8.89 26.42,8.89 v27.94,10.41 | IC2.11 C3.2 66.03,9.26 66.42,9.65 66.42,10.41 v66.55,10.54 | IC1.11 60.69,24.77 C1.2 60.95,26.15 61.98,27.18 61.98,29.46 64.77,32.26 v64.77,32.64 | R36.2 v99.69,22.35 88.81,22.35 | v99.69,24.13 99.69,26.19 C16.- | R28.2 88.81,22.35 | 88.81,22.35 77.51,22.35 R23.2 76.16,21.34 v75.18,21.34 | R15.2 41.27,27.94 | 41.27,27.94 40.89,28.32 29.59,28.32 | 29.59,28.32 29.21,27.94 R20.2 | 29.59,28.32 28.57,28.32 | 28.57,28.32 v23.62,28.32 | v20.7,28.32 17.95,28.32 R18.2 | 41.27,27.94 41.66,28.32 v41.78,28.32 | v41.78,30.1 47.15,30.1 50.27,33.22 X1.7 | R42.2 v21.59,5.97 | v27.94,13.08 v27.94,16.89 | v27.94,27.3 27.94,27.69 28.57,28.32
  Top 0.61: C16.- 102.87,29.36 102.87,33.66 101.6,34.92 v68.58,34.92
  Top 1.016: D2.A 100.33,29.36 C16.-
  Bottom 0.305: v99.69,22.35 v99.69,24.13 | v23.62,28.32 v20.7,28.32 | v41.78,28.32 v41.78,30.1 | v21.59,5.97 v21.59,8.89 | v27.94,10.41 v27.94,13.08 | v27.94,16.89 v27.94,27.3 | v75.18,21.34 75.18,19.68 66.55,11.05 v66.55,10.54 | v64.77,32.64 64.77,34.8 65.53,35.56
  Bottom 0.61: X1.7 51.83,35.56 65.53,35.56 67.94,35.56 v68.58,34.92
AUDIO_IN
  Top 0.305: IC1.5 54.34,24.11 55.12,24.89 55.12,28.83 56.13,29.84 58.29,29.84 60.43,31.98 X1.11
AUDIO_OUT
  Top 0.305: X1.12 62.97,33 59.03,29.06 59.03,28.52 | IC1.14 58.78,28.26 59.03,28.52 | 59.03,28.52 R3.1
DEPTH_IN  (via drill 0.4)
  Top 0.305: v40.01,27.43 40.01,20.95 40.64,20.32 R8.2
  Bottom 0.305: X1.3 40.11,27.54 v40.01,27.43
DEPTH_VCA_OUT
  Top 0.305: R36.1 101.46,19.47 | 101.46,19.47 Q24.2 | C14.1 102.23,20.25 101.46,19.47
F_CV2_POSTDIV
  Top 0.305: Q26.1 51.57,13.19 39.27,13.19 R67.1 38.7,13.46 R64.1
F_CV_POSTDIV
  Top 0.305: R65.1 44.79,11.18 R66.1 45.34,10.63 51.55,10.63 Q25.1
F_CV_PREDIV
  Top 0.305: 7.09,8.04 R4.1 3.81,8.04 R38.2 | 7.09,8.04 IC3.7 | 7.09,8.04 8.78,6.35 11.43,6.35 12.06,6.99 38.06,6.99 40.13,9.06 R66.2
FB_IN  (via drill 0.4)
  Top 0.305: X1.4 42.65,33.55 45.21,30.99 v45.59,30.99 | v45.59,26.8 45.59,24.89 46.35,24.13 46.35,22.23 45.47,21.34 45.47,18.03 46.77,16.73 R1.2
  Bottom 0.305: v45.59,30.99 v45.59,26.8
FB_TO_MIX
  Top 0.305: IC1.2 51.19,26.07 R25.2 49.31,26.45 48.64,25.78 48.64,21.85 49.81,20.68 RV6.3 50.82,20.68 51.44,20.07 51.44,17.4 52.32,16.51 56.41,16.51 60.66,12.27 66.02,12.27 70.03,8.26 81.32,8.26 82.97,6.6 R2.1
FILTER_OUT
  Top 0.305: R29.1 85.51,21.17 87.21,19.47 R28.1 | R28.1 87.63,18.06 Q22.2 | R34.2 89.53,19.68 89.32,19.47 R28.1
FREQ_IN_1  (via drill 0.4)
  Top 0.305: v32.89,10.54 32.89,10.16 35.31,7.75 v36.7,7.75 | v32.89,13.84 32.58,14.15 32.58,22.91 34.29,24.61 v34.29,27.43
  Bottom 0.305: v36.7,7.75 RV2.3 | v32.89,13.84 v32.89,10.54 | v34.29,27.43 34.29,33.26 X1.1
FREQ_IN_2
  Top 0.305: R12.2 1.91,22.77 9.11,29.97 35.05,29.97 37.57,32.49 X1.2
GND  (via drill 0.4)
  Top 0.305: IC3.12 13.35,12.08 v12.7,11.43 13.35,10.78 IC3.10 | IC1.3 50.69,25.41 v50.55,25.27 | IC1.12 57.42,25.41 v57.15,25.15 | v62.61,9.4 62.75,9.54 IC2.12 62.88,9.54 62.74,9.4 62.74,8.51 63.01,8.24 IC2.10 | IC2.5 58.91,8.24 59.18,8.51 | 59.18,8.51 59.18,9.27 58.91,9.54 IC2.3 | IC3.3 9.92,12.08 v10.16,12.32 | IC3.5 9.92,10.78 v10.16,10.54 | 59.18,8.51 59.18,6.22 v59.05,6.1
  other vias: 12.06,27.43 10.16,27.43 24.77,27.43 22.86,27.43 71.75,22.35 82.04,21.21 69.85,22.35 79.5,21.21 38.73,27.43 36.83,27.43 38.73,15.88 98.3,21.21 94.11,21.21 97.16,10.67 49.53,25.27 62.23,26.04 66.67,20.07 54.61,9.91 67.31,9.91 4.06,11.43 18.92,11.43 4.83,19.3 18.41,18.67 62.36,17.53 78.74,14.61 40.77,11.18 35.56,14.61 65.28,25.53 102.87,25.27 104.01,7.62 96.27,8.51 96.27,6.73
  pour Top (isolate 0.305): 0,0 105,0 105,36.5 0,36.5
  pour Bottom (isolate 0.305): 0,0 105,0 105,36.5 0,36.5
I_E_F1
  Top 0.305: R49.2 7.46,16.93 Q27.3
I_E_F2
  Top 0.305: R50.2 22.1,17.06 22.07,17.06 21.98,17.14 Q28.3
I_E_F3
  Top 0.305: R51.2 63.92,16.51 Q29.3
I_E_F4
  Top 0.305: Q30.3 80.59,11.8 R44.2
IN_AUDIO_MIX  (via drill 0.4)
  Top 0.305: C9.2 R16.2 16.3,16.93 17.02,17.65 v17.02,20.7 | v17.02,23.11 23.11,29.21 49.74,29.21 R25.1 | R25.1 51.54,28.16 IC1.1 | X1.8 52.81,30.16 R25.1
  Bottom 0.305: v17.02,23.11 v17.02,20.7
IN_TO_OUT_SW
  Top 0.305: R27.2 55.35,32.49 X1.9
INVERT_SW  (via drill 0.4)
  Top 0.305: IC1.10 62.03,24.11 R32.1 63.25,22.9 63.25,28.7 v62.87,29.08
  Bottom 0.305: v62.87,29.08 57.95,34 X1.10
N$1
  Top 1.016: SV1.1 95.5,33.02 95.76,33.27 D2.C
  Bottom 1.016: SV1.2 SV1.1
N$2
  Top 0.305: RV1.1 8.23,1.27 19.9,1.27 R42.1
N$3
  Top 0.305: IC1.8 60.22,21.38 R30.1 61.34,20.99 61.34,19.88 R43.2
N$4
  Top 0.305: R70.1 47.24,25.57 47.24,20.12 RV6.2
N$5
  Top 0.305: RV7.3 54.06,18.68 53.21,19.54 53.21,21.46 56.13,24.38 56.13,25.65 56.55,26.07 | 56.55,26.07 IC1.13 59.59,26.07 60.79,27.27 R3.2 | R27.1 57.15,26.67 56.55,26.07
N$7
  Top 0.305: IC1.6 IC1.7 52.07,21.91 52.07,17.78 52.58,17.27 56.77,17.27 61.09,12.95 66.32,12.95 70.39,8.89 82.04,8.89 83.31,7.62 93.88,7.62 RV5.3
N$9
  Top 0.305: R7.2 52.07,3.43 RV3.2
N$10
  Top 0.305: R2.2 90.15,6.35 RV5.2
N$12  (via drill 0.4)
  Top 0.305: R9.1 R13.2 66.28,7.59 IC2.9 62.51,7.59 61.59,8.51 v61.59,9.4 | R8.1 42.33,15.88 49.54,15.88 49.83,15.58 56.3,15.58 60.83,11.05 v61.34,11.05
  Bottom 0.305: v61.59,9.4 61.59,10.79 v61.34,11.05
N$13
  Top 0.305: R4.2 6.11,10.13 IC3.6 9.43,10.13 10.16,9.4 | R5.1 30.48,7.87 11.68,7.87 10.16,9.4 | R6.1 10.16,9.4
N$14  (via drill 0.4)
  Top 0.305: IC2.6 55.63,7.59 R14.2 R7.1 49.82,7.2 48.51,8.51 v48.26,8.51 | v48.26,13.97 R1.1
  Bottom 0.305: v48.26,8.51 v48.26,13.97
N$15
  Top 1.016: D1.A 68.2,33.02 81.28,33.02 82.55,31.75 SV1.9
  Bottom 1.016: SV1.10 SV1.9
N$18  (via drill 0.4)
  Top 0.305: IC2.7 56.62,5.5 R14.1 54.19,5.5 53.34,6.35 49.15,6.35 v46.99,8.51 | R26.2 36.83,15.91 37.76,14.99 45.97,14.99 v46.99,13.97
  Bottom 0.305: v46.99,13.97 v46.99,8.51
N$20
  Top 0.305: Q1.2 R56.1
N$21
  Top 0.305: C13.2 46.89,27.62 R70.2
N$23
  Top 0.305: IC3.9 IC3.8
N$24
  Top 0.305: Q3.2 38.1,23.28 R62.1 35.99,24.55 R40.1
N$26
  Top 0.305: Q3.5 Q3.4 36.83,20.17 R26.1
N$27
  Top 0.305: R15.1 43.04,24.55 | 43.04,24.55 Q18.2 | C13.1 43.5,25.01 43.04,24.55
N$28
  Top 0.305: Q9.2 Q9.1 33.54,21.59 | Q9.6 33.54,21.59 | Q3.3 36.71,22.49 35.81,21.59 33.54,21.59
N$31
  Top 0.305: Q9.3 35.93,20.69 36.83,21.59 38.48,21.59 38.85,21.22 Q3.6 38.85,18.75 R47.1 39.28,18.63 39.5,18.41 42.83,18.41 Q17.1
N$32
  Top 0.305: Q3.1 38.85,24.43 R63.1
N$34
  Top 0.305: Q18.1 Q17.2
N$35
  Top 0.305: Q5.2 82.55,17.95 81.03,19.47 R52.1
N$36
  Top 0.305: R5.2 30.48,4.52 RV2.2
N$37
  Top 0.305: R6.2 10.16,4.34 RV1.2
N$38
  Top 0.305: R41.2 16.34,3.44 RV1.3
N$39
  Top 0.305: Q1.5 Q1.4 8.26,19.54 R49.1
N$40
  Top 0.305: Q5.5 Q5.4 80.64,14.46 R44.1
N$41
  Top 0.305: Q11.3 80.63,15.61 81.53,16.51 82.93,16.51 83.3,16.14 Q5.6 83.3,14.3 82.7,13.7 | 82.7,13.7 C12.1 | Q21.1 87.91,12.7 83.69,12.7 82.7,13.7
N$42
  Top 0.305: R29.2 R53.1 83.3,19.36 Q5.1 84.45,16.25 R39.1
N$43
  Top 0.305: Q22.1 Q21.2
N$44
  Top 0.305: Q11.6 77.99,16.51 | 77.99,16.51 Q11.1 Q11.2 | Q5.3 81.16,17.41 80.26,16.51 77.99,16.51
N$45
  Top 0.305: R48.1 53.36,12.08 Q25.2 51.57,12.21 22.72,12.21 18.43,16.5 Q28.2 17.53,15.62 5.59,15.62 4.82,16.39 Q27.2
N$46
  Top 0.305: 56.58,10.91 56.54,10.95 52.93,10.95 52.45,11.43 Q25.3 | R69.2 59.94,5.68 59.94,9.65 59.41,10.19 IC2.2 57.3,10.19 57.24,10.25 56.58,10.91 | C17.1 56.58,10.91
N$48
  Top 0.305: R48.2 56.84,12.06 | 56.84,12.06 57.09,12.06 58.06,11.09 IC2.1 | C17.2 56.69,12.21 56.84,12.06
N$49
  Top 0.305: R31.2 R32.2 66.64,22.86 R33.1 66.67,23.24 66.72,23.28 101.5,23.28 C14.2
N$50
  Top 0.305: R43.1 RV7.2
N$51
  Top 0.305: IC1.9 60.57,23.46 R30.2 61.25,23.07 63.28,21.04 R31.1
N$52  (via drill 0.4)
  Top 0.305: IC2.8 65.3,5.5 R13.1 69,5.5 69.85,6.35 80.77,6.35 v81.41,6.99 | R35.2 92.29,8.89 v83.31,8.89
  Bottom 0.305: v81.41,6.99 v83.31,8.89
N$53
  Top 0.305: Q7.3 7.99,20.69 8.89,21.59 10.54,21.59 10.91,21.22 Q1.6 10.91,19.38 10.37,18.84 | 10.37,18.84 C9.1 | Q13.1 15.01,17.78 11.18,17.78 10.37,18.59 10.37,18.84
N$54
  Top 0.305: Q7.2 Q7.1 5.6,21.59 | 5.6,21.59 Q7.6 | Q1.3 8.77,22.49 7.87,21.59 5.6,21.59
N$55
  Top 0.305: R17.2 R57.1 10.91,23.39 Q1.1 12.06,21.34 R16.1
N$56
  Top 0.305: Q14.1 Q13.2
N$57  (via drill 0.4)
  Top 0.305: Q30.2 77.58,13.47 77.58,12.46 74.8,9.67 70.72,9.67 66.55,13.84 64.14,13.84 63.75,14.22 | 63.75,14.22 62.12,15.86 Q29.2 60.72,15.86 59.56,17.02 v58.29,17.02 | Q26.2 51.83,14.75 55.87,14.75 v55.88,14.73 | R46.1 63.75,14.22
  Bottom 0.305: v55.88,14.73 58.17,17.02 v58.29,17.02
N$58
  Top 0.305: Q6.2 96.52,18.2 R54.1 93.78,19.47 R34.1
N$59
  Top 0.305: Q2.2 24.13,23.28 R58.1
N$60
  Top 0.305: R50.1 22.23,19.54 Q2.4 Q2.5
N$61
  Top 0.305: Q6.5 Q6.4 95.25,15.09 R35.1
N$64
  Top 0.305: Q8.3 22.09,20.69 22.99,21.59 24.64,21.59 24.88,21.35 Q2.6 24.88,19.38 24.21,18.71 | 24.21,18.71 C10.1 | Q15.1 28.98,17.78 25.15,17.78 24.21,18.71
N$67
  Top 0.305: R21.2 R59.1 24.88,24.43 Q2.1 26.04,21.34 R19.1
N$68
  Top 0.305: R68.2 62.87,5.17 60.71,7.33 60.71,10.03 | Q26.3 52.7,13.97 53.47,13.21 57.53,13.21 60.71,10.03 | 60.71,10.03 60.86,10.19 IC2.13 65.36,10.19 C18.1
N$69
  Top 0.305: Q12.6 91.96,16.51 | 91.96,16.51 Q12.1 Q12.2 | Q6.3 95.13,17.41 94.23,16.51 91.96,16.51
N$70
  Top 0.305: Q16.1 Q15.2
N$73
  Top 0.305: Q12.3 94.48,15.61 95.38,16.51 96.9,16.51 97.27,16.14 Q6.6 97.27,14.43 | 97.27,14.43 97.27,13.66 R45.1 | Q23.1 102.34,14.43 97.27,14.43
N$74
  Top 0.305: Q6.1 97.27,19.36 R55.1
N$77
  Top 0.305: Q8.6 19.57,21.59 | 19.57,21.59 Q8.1 Q8.2 | Q2.3 22.74,22.49 21.84,21.59 19.57,21.59
N$78
  Top 0.305: Q23.2 Q24.1
N$79
  Top 0.305: Q4.2 R60.1
N$80
  Top 0.305: Q4.5 Q4.4 68.73,15.24 R51.1
N$81  (via drill 0.4)
  Top 0.305: v62.61,11.3 63.07,10.84 IC2.14 64.47,11.45 C18.2 | R46.2 61.34,14.1 v60.96,14.48
  Bottom 0.305: v62.61,11.3 62.23,11.68 62.23,13.21 v60.96,14.48
N$82
  Top 0.305: Q10.3 67.16,16.51 70.1,16.51 70.6,16.01 Q4.6 70.6,13.66 70.5,13.57 | Q19.1 75.21,12.7 72.39,12.7 71.75,12.7 71.37,12.7 70.5,13.57 | 70.5,13.57 C11.1
N$83
  Top 0.305: R24.2 R61.1 70.6,18.32 Q4.1 72.39,15.62 R22.1
N$84
  Top 0.305: Q20.1 Q19.2
N$85
  Top 0.305: Q10.6 65.29,17.78 | 65.29,17.78 Q10.1 Q10.2 | 65.29,17.78 68.73,17.78 Q4.3
N$86
  Top 0.305: R9.2 72.39,3.61 RV4.2
N$87
  Top 0.305: R38.1 2.54,11.56 3.64,12.66 R37.2 4.28,12.7 8.5,12.7 IC3.2
N$89
  Top 0.305: IC3.1 5.67,13.38 3.39,15.66 R11.2 1.91,13.37 R37.1
N$90
  Top 0.305: R10.2 16.45,12.73 IC3.13 13.43,12.73 12.06,14.1 5.97,14.1 2.71,17.36 R11.1 R12.1
N$93
  Top 0.305: IC3.14 15.03,13.38 15.75,14.1 17.65,14.1 18.38,13.37 R10.1 19.76,12.95 21.37,11.34 R67.2
OUT_1
  Top 0.305: R17.1 14.14,26.25 15.84,24.55 R18.1 15.62,24.3 15.62,22.25 Q14.2 18.27,22.24 18.8,21.72 18.8,19.81 19.81,18.8 20.19,18.8 21.21,17.78 23.28,17.78 C10.2 R19.2
OUT_2  (via drill 0.4)
  Top 0.305: R21.1 27.09,26.25 28.79,24.55 R20.1 | R20.1 29.21,22.63 Q16.2 | R22.2 C11.2 70.48,11.05 v70.74,10.79 | R20.1 31.75,24.55 | 31.75,24.55 32.17,24.55 33.02,25.4 R40.2 | v34.16,12.95 32.38,12.95 31.75,13.59 31.75,24.55 | v34.29,10.54 34.92,9.91 51.82,9.91 v53.59,8.13
  Bottom 0.305: v34.16,12.95 34.29,12.83 v34.29,10.54 | v70.74,10.79 68.07,8.13 v53.59,8.13
OUT_3  (via drill 0.4)
  Top 0.305: R24.1 74.08,21.17 75.78,19.47 R23.1 76.33,17.66 Q20.2 76.44,17.16 76.83,16.76 76.83,12.7 76.07,11.94 v75.82,11.94 | R39.2 C12.2 82.55,11.55 81.64,10.64 77.11,10.64 v77.09,10.67
  Bottom 0.305: v77.09,10.67 v75.82,11.94

### Text on the board
tPlace: beatrix B v1.1 | (c) 2021 expert sleepers | Feedback | Depth | -12V